# Altium schematic sheet Practica 4 - Boton ON - OFF.SchDoc
size Legal; Engineer: Roberto Isaac Suaste Martinez; Organization: Mecatronica Digital; Address1: www.mecatronicadigital.com; Address2: info@mecatronicadigital.com; Address3: Dpto. Diseño Electronico
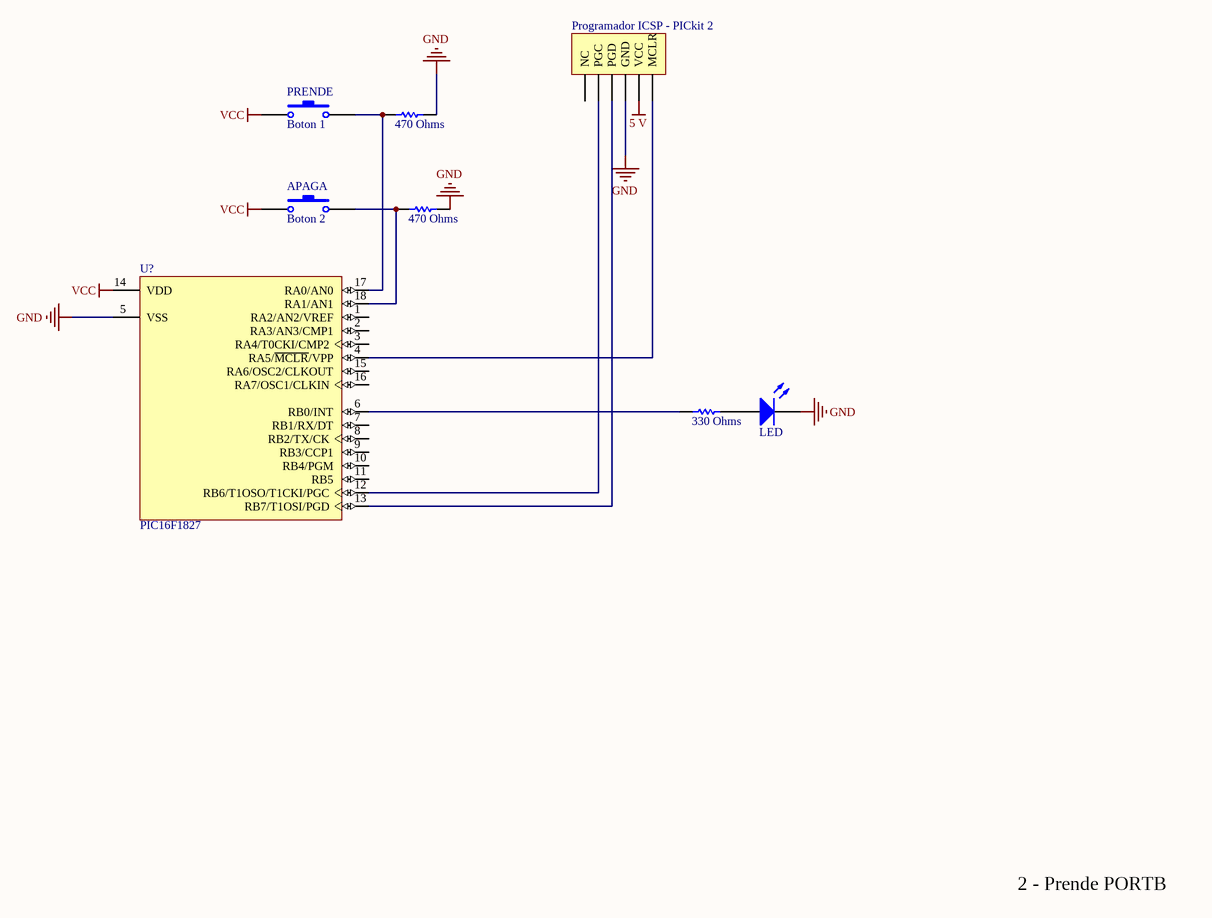
[diagram p0: Practica 4 - Boton ON - OFF.SchDoc]

## Parts
(Parts that share a designator on the sheet are numbered #1, #2 ... from top to bottom, then left to right.)
330_Ohms  Resistencia 1/4 de watt  [330 Ohm]  (value not drawn)
470_Ohms#1  Resistencia 1/4 de watt  [330 Ohm]  (value not drawn)
470_Ohms#2  Resistencia 1/4 de watt  [330 Ohm]  (value not drawn)
APAGA  Boton 2  [Tact Switch THT 7.0mm stem]
D?  LED  [LED5MM GREEN]
PRENDE  Boton 1  [Tact Switch THT 7.0mm stem]
Programador_ICSP_-_PICkit_2  Header 6  [Header 1X6]  (value not drawn)
U?  PIC16F1827  [PDIP300-P18]

## Nets
5 V: Programador_ICSP_-_PICkit_2.2(VCC)
GND: 470_Ohms#1.2 470_Ohms#2.2 D?.2(K) Programador_ICSP_-_PICkit_2.3(GND) U?.5(VSS)
VCC: APAGA.1 PRENDE.1 U?.14(VDD)
Net330_Ohms_1: 330_Ohms.1 U?.6(RB0/INT)
Net330_Ohms_2: 330_Ohms.2 D?.1(A)
Net470_Ohms#1_1: 470_Ohms#1.1 PRENDE.2 U?.17(RA0/AN0)
Net470_Ohms#2_1: 470_Ohms#2.1 APAGA.2 U?.18(RA1/AN1)
NetProgramador_ICSP_-_PICkit_2_1: Programador_ICSP_-_PICkit_2.1(MCLR) U?.4(RA5/~{MCLR}/VPP)
NetProgramador_ICSP_-_PICkit_2_4: Programador_ICSP_-_PICkit_2.4(PGD) U?.13(RB7/T1OSI/PGD)
NetProgramador_ICSP_-_PICkit_2_5: Programador_ICSP_-_PICkit_2.5(PGC) U?.12(RB6/T1OSO/T1CKI/PGC)

Not connected (* = marked no-connect by the designer): Programador_ICSP_-_PICkit_2 6(NC); U? 1(RA2/AN2/VREF) 2(RA3/AN3/CMP1) 3(RA4/T0CKI/CMP2) 7(RB1/RX/DT) 8(RB2/TX/CK) 9(RB3/CCP1) 10(RB4/PGM) 11(RB5) 15(RA6/OSC2/CLKOUT) 16(RA7/OSC1/CLKIN)

## Notes on the sheet
- 2 - Prende PORTB
- Proyecto:
- Practica
- Ingeniero:
- Size:
- Fecha:
- A4
- Documento Numero:
- Hora:
- Revision:

## Library data of the parts
330_Ohms 470_Ohms#1 470_Ohms#2 = Resistor 1/4 watt: Resistor empaque ceramico axial de 1/4 de watt; Published: 8-Jun-2000; LatestRevisionDate: 17-Jul-2002; LatestRevisionNote: Re-released for DXP Platform.; PackageReference: AXIAL-0.5; Publisher: Altium Limited
APAGA PRENDE = Push Button: Switch; Published: 24-Mar-1999; LatestRevisionDate: 17-Jul-2002; LatestRevisionNote: Re-released for DXP Platform.; PackageReference: SPST-2; Publisher: Altium Limited
D? = LED: Typical INFRARED GaAs LED; Published: 8-Jun-2000; LatestRevisionDate: 08-Jul-2005; LatestRevisionNote: Mech Layer 1 removed.; Publisher: Altium Limited
Programador_ICSP_-_PICkit_2 = Header 6: Header, 6-Pin; LatestRevisionDate: 17-Jul-2002; LatestRevisionNote: Re-released for DXP Platform.; Publisher: Altium Limited
U? = PIC16F628A-I/P: FLASH-Based 8-Bit CMOS Microcontroller with nanoWatt Technology, 2K (x14-Bit words) FLASH, 224 Bytes SRAM, 18-Pin PDIP, 3.0 to 5.5V Supply Range, Industrial Temperature; Published: 11-Oct-2004; LatestRevisionDate: 29-Jan-2009; LatestRevisionNote: Sch. layout revised. 3D Model Removed.; DatasheetVersion: revF, Mar-2007; PackageVersion: revBB, Aug-2009; PackageReference: PDIP300-P18; Publisher: Altium Limited; PackageDescription: 18-Lead Plastic Dual In-Line (P) - 300 mil Body [PDIP]; Supplier 1: Digi-Key; Supplier Part Number 1: PIC16F628A-I/P-ND; Supplier 2: Farnell; Supplier Part Number 2: 9771549; Supplier 3: Farnell; Supplier Part Number 3: 1523938; Supplier 4: Farnell; Supplier Part Number 4: 9760423; Code_JEDEC: MS-001; ComponentLink1Description: Datasheet; ComponentLink1URL: http://ww1.microchip.com/downloads/en/DeviceDoc/40044F.pdf; ComponentLink2Description: Packaging Specification; ComponentLink2URL: http://www.microchip.com/stellent/groups/techpub_sg/documents/packagingspec/en012702.pdf; ComponentLink3Description: Microchip.com Home; ComponentLink3URL: http://www.microchip.com/